# EAGLE design Secondary (EAGLE 5.12)

## Sheet 1 of 3
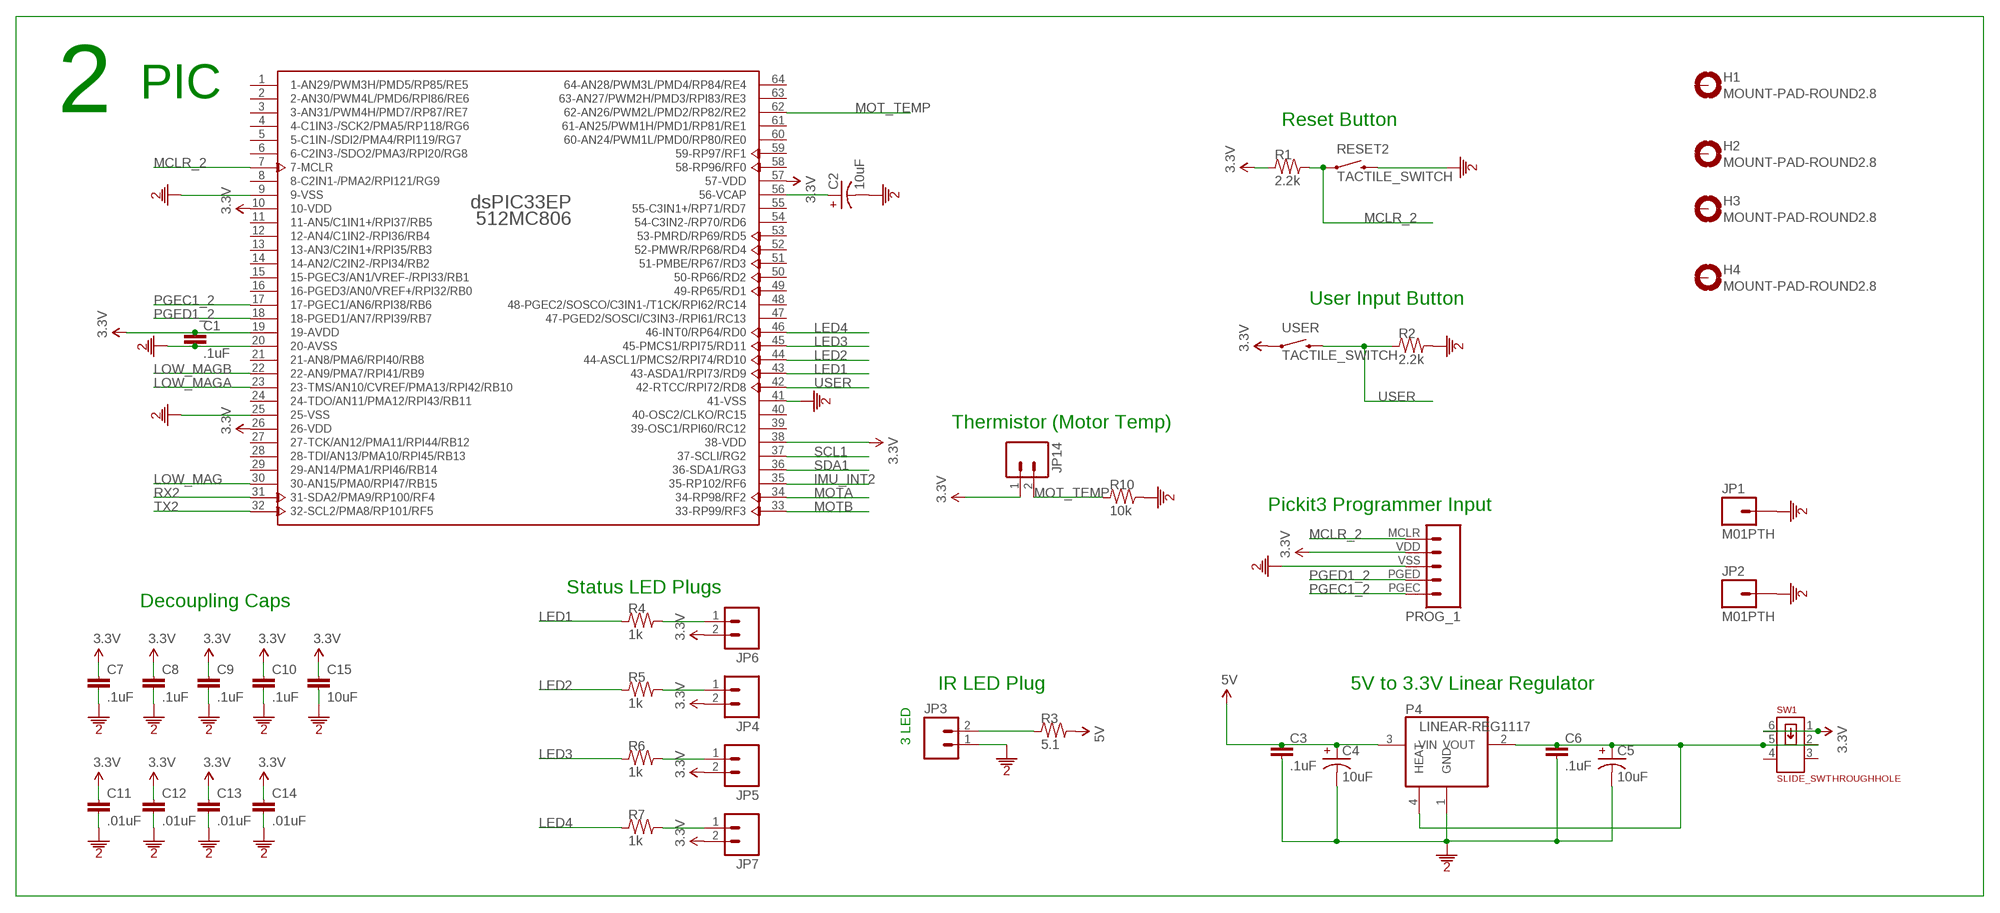
[diagram p0: schematic, sheet 1]

### Parts
C1  .1uF  CAP0603  [0603]
C2  10uF  CAP-POL0603  [0603-POL]
C3  .1uF  CAP1206  [1206]
C4  10uF  CAP-POL0603  [0603-POL]
C5  10uF  CAP-POL0603  [0603-POL]
C6  .1uF  CAP1206  [1206]
C7  .1uF  CAP0603  [0603]
C8  .1uF  CAP0603  [0603]
C9  .1uF  CAP0603  [0603]
C10  .1uF  CAP0603  [0603]
C11  .01uF  CAP0603  [0603]
C12  .01uF  CAP0603  [0603]
C13  .01uF  CAP0603  [0603]
C14  .01uF  CAP0603  [0603]
C15  10uF  CAP1206  [1206]
H1  MOUNT-PAD-ROUND2.8  [2,8-PAD]
H2  MOUNT-PAD-ROUND2.8  [2,8-PAD]
H3  MOUNT-PAD-ROUND2.8  [2,8-PAD]
H4  MOUNT-PAD-ROUND2.8  [2,8-PAD]
JP1  M01PTH  [1X01]
JP2  M01PTH  [1X01]
JP3  M02JST-PH-SMD  [JST-2-PH-SMD]
JP4  M02JST-PH-V  [JST-2-PH-V]
JP5  M02JST-PH-V  [JST-2-PH-V]
JP6  M02JST-PH-V  [JST-2-PH-V]
JP7  M02JST-PH-V  [JST-2-PH-V]
JP14  M02JST-PH-TH  [JST-2-PH-TH]
P4  LINEAR-REG1117  [SOT223]
PROG_1  M05PICKIT3  [1X05-PICKIT3]
R1  2.2k  R0603  [0603]
R2  2.2k  R0603  [0603]
R3  5.1  R0603  [0603]
R4  1k  R0603  [0603]
R5  1k  R0603  [0603]
R6  1k  R0603  [0603]
R7  1k  R0603  [0603]
R10  10k  R0603  [0603]
RESET2  TACTILE_SWITCH  [TACTILE_SWITCH]
SW1  SLIDE_SWTHROUGHHOLE  [SLIDE_SWITCH]
U$1  DSPIC33EP512MC806  [TQFP64_10X10]
USER  TACTILE_SWITCH  [TACTILE_SWITCH]

### Nets
3.3V: C1.1 C7.1 C8.1 C9.1 C10.1 C11.1 C12.1 C13.1 C14.1 C15.1 JP4.2 JP5.2 JP6.2 JP7.2 JP14.1 PROG_1.VDD R1.1 SW1.1 SW1.6 U$1.10(10-VDD) U$1.19(19-AVDD) U$1.26(26-VDD) U$1.38(38-VDD) U$1.57(57-VDD) USER.1 ; also sheet 2
5V: C3.1 C4.+ P4.3(VIN) R3.2 ; also sheet 2,3
GND2: C1.2 C2.- C3.2 C4.- C5.- C6.2 C7.2 C8.2 C9.2 C10.2 C11.2 C12.2 C13.2 C14.2 C15.2 JP1.1 JP2.1 JP3.1 P4.1(GND) PROG_1.VSS R2.2 R10.2 RESET2.2 U$1.9(9-VSS) U$1.20(20-AVSS) U$1.25(25-VSS) U$1.41(41-VSS) ; also sheet 2,3
IMU_INT2: U$1.35(35-RP102/RF6) ; also sheet 2
LED1: R4.1 U$1.43(43-ASDA1/RPI73/RD9)
LED2: R5.1 U$1.44(44-ASCL1/PMCS2/RPI74/RD10)
LED3: R6.1 U$1.45(45-PMCS1/RPI75/RD11)
LED4: R7.1 U$1.46(46-INT0/RP64/RD0)
LOW_MAG: U$1.30(30-AN15/PMA0/RPI47/RB15) ; also sheet 2
LOW_MAGA: U$1.23(23-TMS/AN10/CVREF/PMA13/RPI42/RB10) ; also sheet 2
LOW_MAGB: U$1.22(22-AN9/PMA7/RPI41/RB9) ; also sheet 2
MCLR_2: PROG_1.MCLR R1.2 RESET2.1 U$1.7(7-MCLR)
MOT_TEMP: JP14.2 R10.1 U$1.62(62-AN26/PWM2L/PMD2/RP82/RE2)
MOTA: U$1.34(34-RP98/RF2) ; also sheet 2
MOTB: U$1.33(33-RP99/RF3) ; also sheet 2
N$2: C2.+ U$1.56(56-VCAP)
N$3: JP3.2 R3.1
N$4: C5.+ C6.1 P4.2(VOUT) SW1.2 SW1.5
N$5: P4.4(HEAT)
N$6: JP7.1 R7.2
N$7: JP5.1 R6.2
N$8: JP4.1 R5.2
N$9: JP6.1 R4.2
PGEC1_2: PROG_1.PGEC U$1.17(17-PGEC1/AN6/RPI38/RB6)
PGED1_2: PROG_1.PGED U$1.18(18-PGED1/AN7/RPI39/RB7)
RX2: U$1.31(31-SDA2/PMA9/RP100/RF4) ; also sheet 2
SCL1: U$1.37(37-SCLI/RG2) ; also sheet 2
SDA1: U$1.36(36-SDA1/RG3) ; also sheet 2
TX2: U$1.32(32-SCL2/PMA8/RP101/RF5) ; also sheet 2
USER: R2.1 U$1.42(42-RTCC/RPI72/RD8) USER.2
Unconnected: H1.B2,8(MOUNT) H2.B2,8(MOUNT) H3.B2,8(MOUNT) H4.B2,8(MOUNT) SW1.3 SW1.4 U$1.1(1-AN29/PWM3H/PMD5/RP85/RE5) U$1.2(2-AN30/PWM4L/PMD6/RPI86/RE6) U$1.3(3-AN31/PWM4H/PMD7/RP87/RE7) U$1.4(4-C1IN3-/SCK2/PMA5/RP118/RG6) U$1.5(5-C1IN-/SDI2/PMA4/RPI119/RG7) U$1.6(6-C2IN3-/SDO2/PMA3/RPI20/RG8) U$1.8(8-C2IN1-/PMA2/RPI121/RG9) U$1.11(11-AN5/C1IN1+/RPI37/RB5) U$1.12(12-AN4/C1IN2-/RPI36/RB4) U$1.13(13-AN3/C2IN1+/RPI35/RB3) U$1.14(14-AN2/C2IN2-/RPI34/RB2) U$1.15(15-PGEC3/AN1/VREF-/RPI33/RB1) U$1.16(16-PGED3/AN0/VREF+/RPI32/RB0) U$1.21(21-AN8/PMA6/RPI40/RB8) U$1.24(24-TDO/AN11/PMA12/RPI43/RB11) U$1.27(27-TCK/AN12/PMA11/RPI44/RB12) U$1.28(28-TDI/AN13/PMA10/RPI45/RB13) U$1.29(29-AN14/PMA1/RPI46/RB14) U$1.39(39-OSC1/RPI60/RC12) U$1.40(40-OSC2/CLKO/RC15) U$1.47(47-PGED2/SOSCI/C3IN3-/RPI61/RC13) U$1.48(48-PGEC2/SOSCO/C3IN1-/T1CK/RPI62/RC14) U$1.49(49-RP65/RD1) U$1.50(50-RP66/RD2) U$1.51(51-PMBE/RP67/RD3) U$1.52(52-PMWR/RP68/RD4) U$1.53(53-PMRD/RP69/RD5) U$1.54(54-C3IN2-/RP70/RD6) U$1.55(55-C3IN1+/RP71/RD7) U$1.58(58-RP96/RF0) U$1.59(59-RP97/RF1) U$1.60(60-AN24/PWM1L/PMD0/RP80/RE0) U$1.61(61-AN25/PWM1H/PMD1/RP81/RE1) U$1.63(63-AN27/PWM2H/PMD3/RPI83/RE3) U$1.64(64-AN28/PWM3L/PMD4/RP84/RE4)

### Notes on the sheet
- 2 | PIC
- Reset Button
- User Input Button
- Thermistor (Motor Temp)
- Pickit3 Programmer Input
- Status LED Plugs
- Decoupling Caps
- IR LED Plug | 5V to 3.3V Linear Regulator
- 3 LED

## Sheet 2 of 3
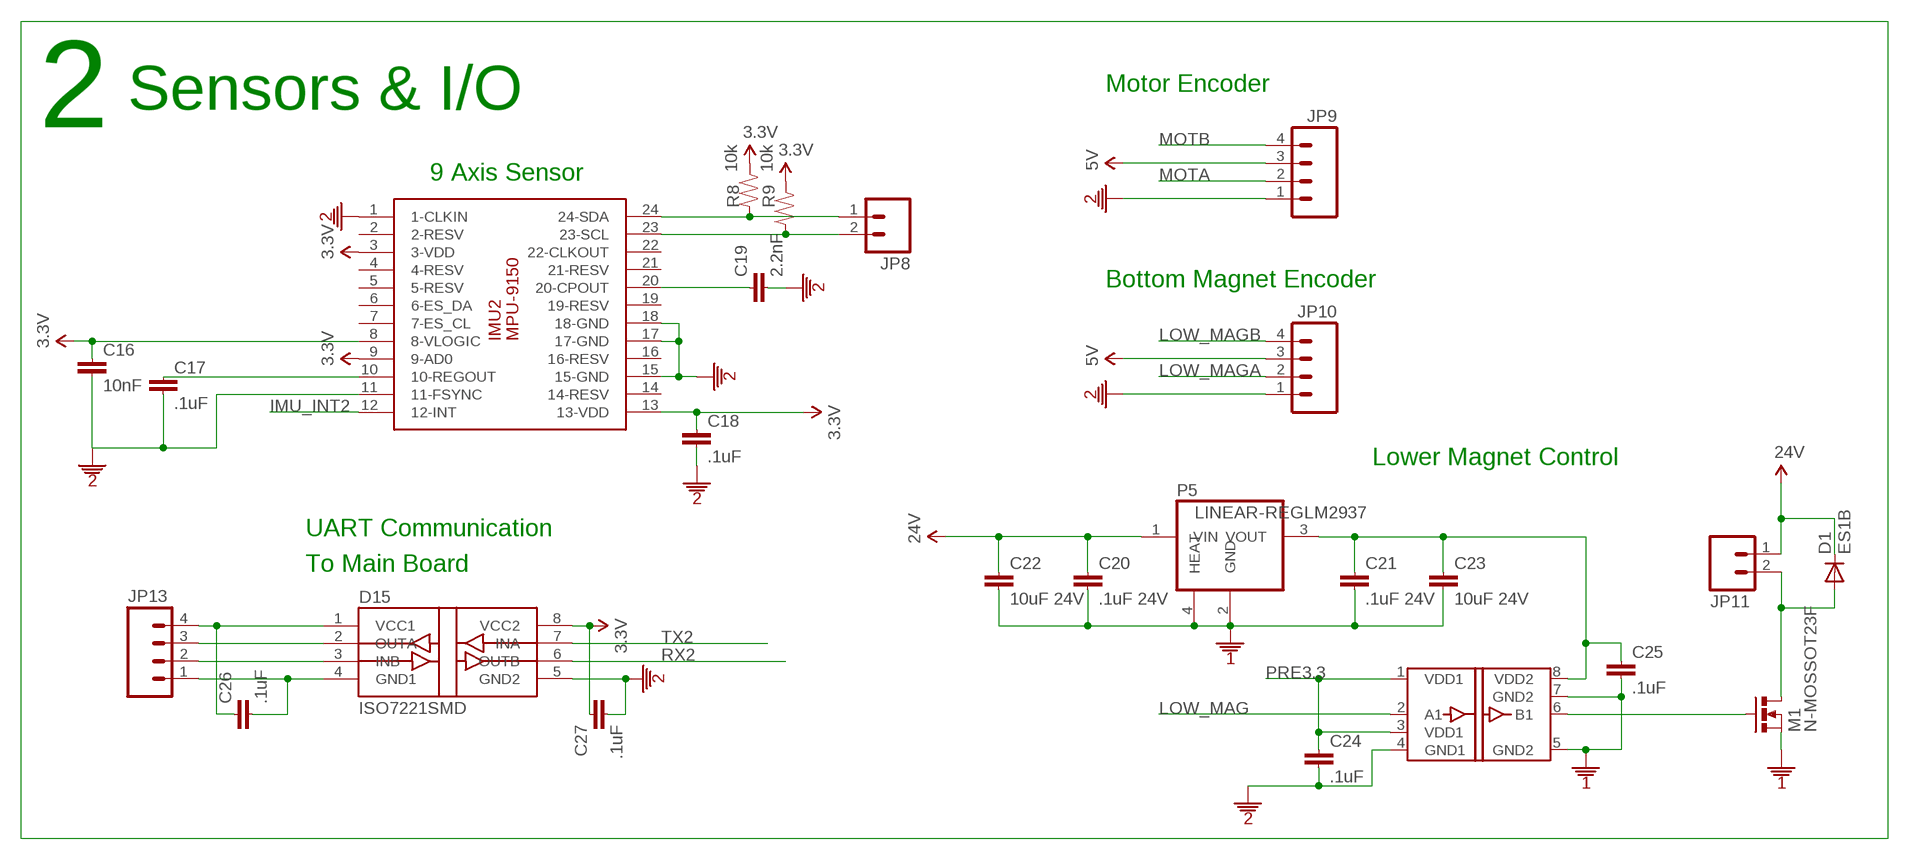
[diagram p1: schematic, sheet 2]

### Parts
C16  10nF  CAP0603  [0603]
C17  .1uF  CAP0603  [0603]
C18  .1uF  CAP0603  [0603]
C19  2.2nF  CAP0603  [0603]
C20  .1uF 24V  CAP0603  [0603]
C21  .1uF 24V  CAP0603  [0603]
C22  10uF 24V  CAP1206  [1206]
C23  10uF 24V  CAP1206  [1206]
C24  .1uF  CAP0603  [0603]
C25  .1uF  CAP0603  [0603]
C26  .1uF  CAP0603  [0603]
C27  .1uF  CAP0603  [0603]
D1  ES1B  DIODESMA  [SMA-DIODE]
D13  DIGITAL-ISOLATOR-1CHSOIC8-N  [SOIC8-N]
D15  ISO7221SMD  [SOIC-8]
IMU2  MPU-9150  [LGA24_4X4]
JP8  M02JST-PH-V  [JST-2-PH-V]
JP9  M04PH-TH  [JST-4-PH-TH]
JP10  M04PH-TH  [JST-4-PH-TH]
JP11  M02JST-PH-TH  [JST-2-PH-TH]
JP13  M04PH-TH  [JST-4-PH-TH]
M1  N-MOSSOT23F  [SOT23F]
P5  LINEAR-REGLM2937  [SOT223]
R8  10k  R0402  [0402]
R9  10k  R0402  [0402]

### Nets
3.3V: C16.1 C18.1 C27.1 D15.8(VCC2) IMU2.3(3-VDD) IMU2.8(8-VLOGIC) IMU2.9(9-AD0) IMU2.13(13-VDD) R8.2 R9.2 ; also sheet 1
5V: JP9.3 JP10.3 ; also sheet 1,3
24V: C20.1 C22.1 D1.C JP11.1 P5.1(VIN) ; also sheet 3
GND1: C20.2 C21.2 C22.2 C23.2 C25.2 D13.5(GND2) D13.7(GND2) M1.S P5.2(GND) P5.4(HEAT) ; also sheet 3
GND2: C16.2 C17.2 C18.2 C19.2 C24.2 C27.2 D13.4(GND1) D15.5(GND2) IMU2.1(1-CLKIN) IMU2.11(11-FSYNC) IMU2.15(15-GND) IMU2.17(17-GND) IMU2.18(18-GND) JP9.1 JP10.1 ; also sheet 1,3
IMU_INT2: IMU2.12(12-INT) ; also sheet 1
LOW_MAG: D13.2(A1) ; also sheet 1
LOW_MAGA: JP10.2 ; also sheet 1
LOW_MAGB: JP10.4 ; also sheet 1
MOTA: JP9.2 ; also sheet 1
MOTB: JP9.4 ; also sheet 1
N$11: C17.1 IMU2.10(10-REGOUT)
N$14: C19.1 IMU2.20(20-CPOUT)
N$15: C21.1 C23.1 C25.1 D13.8(VDD2) P5.3(VOUT)
N$17: D13.6(B1) M1.G
N$18: D1.A JP11.2 M1.D
N$19: C26.1 D15.1(VCC1) JP13.4
N$20: D15.2(OUTA) JP13.3
N$21: D15.3(INB) JP13.2
N$22: C26.2 D15.4(GND1) JP13.1
PRE3.3: C24.1 D13.1(VDD1) D13.3(VDD1)
RX2: D15.6(OUTB) ; also sheet 1
SCL1: IMU2.23(23-SCL) JP8.2 R9.1 ; also sheet 1
SDA1: IMU2.24(24-SDA) JP8.1 R8.1 ; also sheet 1
TX2: D15.7(INA) ; also sheet 1
Unconnected: IMU2.2(2-RESV) IMU2.4(4-RESV) IMU2.5(5-RESV) IMU2.6(6-ES_DA) IMU2.7(7-ES_CL) IMU2.14(14-RESV) IMU2.16(16-RESV) IMU2.19(19-RESV) IMU2.21(21-RESV) IMU2.22(22-CLKOUT)

### Notes on the sheet
- Motor Encoder
- 2 | Sensors & I/O
- 9 Axis Sensor
- Bottom Magnet Encoder
- Lower Magnet Control
- UART Communication
- To Main Board

## Sheet 3 of 3
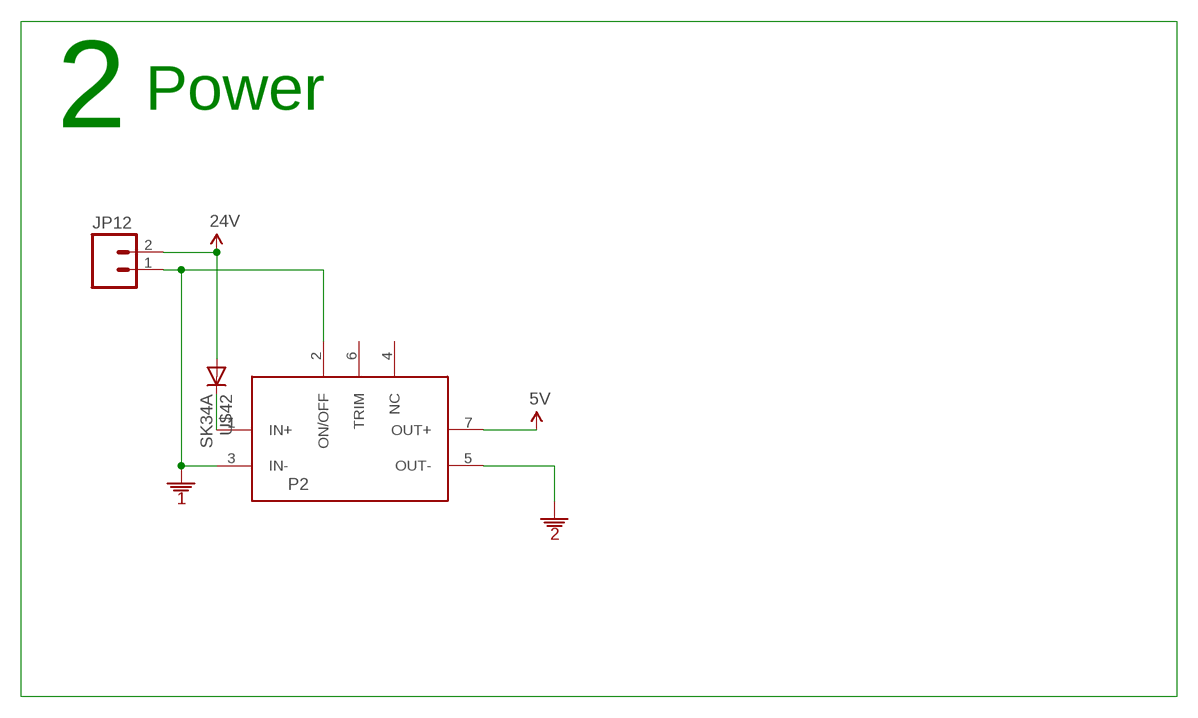
[diagram p2: schematic, sheet 3]

### Parts
JP12  M02JST-PH-TH  [JST-2-PH-TH]
P2  DC-DC-CONVERTER1.2A  [CC6-2405SF-E]
U$42  SK34A  DIODESMA  [SMA-DIODE]

### Nets
5V: P2.7(OUT+) ; also sheet 1,2
24V: JP12.2 U$42.A ; also sheet 2
GND1: JP12.1 P2.2(ON/OFF) P2.3(IN-) ; also sheet 2
GND2: P2.5(OUT-) ; also sheet 1,2
N$12: P2.1(IN+) U$42.C
Unconnected: P2.4(NC) P2.6(TRIM)

### Notes on the sheet
- 2 | Power

## Library data of the parts
C1 C3 C6-C27 = GibbotV5:CAP: Capacitor Standard 0603 ceramic capacitor, and 0.1" leaded capacitor.
C2 C4 C5 = GibbotV5:CAP-POL: CAPACITOR, American symbol
D1 U$42 = GibbotV5:DIODE: Diode These are standard reverse protection diodes and small signal diodes. SMA package can handle up to about 1A. SOD-323 can handle about 200mA. What the SOD-323 package when ordering, there are some mfgs out there that are 5-pin packages.
D13 = GibbotV5:DIGITAL-ISOLATOR-1CH
D15 = GibbotV6:ISO7221
H1-H4 = GibbotV5:MOUNT-PAD-ROUND: MOUNTING PAD, round
IMU2 = GibbotV5:MPU-9150
JP1 JP2 = GibbotV5:M01: Header 1 Standard 1-pin 0.1" header. Use with straight break away headers (SKU : PRT-00116), right angle break away headers (PRT-00553), swiss pins (PRT-00743), machine pins (PRT-00117), and female headers (PRT-00115).
JP3-JP8 JP11 JP12 JP14 = GibbotV5:M02: Header 2 Standard 2-pin 0.1" header. Use with straight break away headers (SKU : PRT-00116), right angle break away headers (PRT-00553), swiss pins (PRT-00743), machine pins (PRT-00117), and female headers (PRT-00115). Molex polarized connector foot print use with SKU : PRT-08233 with associated crimp pins and housings.
JP9 JP10 JP13 = GibbotV5:M04: Header 4 Standard 4-pin 0.1" header. Use with straight break away headers (SKU : PRT-00116), right angle break away headers (PRT-00553), swiss pins (PRT-00743), machine pins (PRT-00117), and female headers (PRT-00115). Molex polarized connector foot print use with SKU : PRT-08231 with associated crimp pins and housings. 1MM SMD Version SKU: PRT-10208
M1 = GibbotV5:N-MOS
P2 = GibbotV5:DC-DC-CONVERTER
P4 P5 = GibbotV5:LINEAR-REG
PROG_1 = GibbotV5:M05: Header 5 Standard 5-pin 0.1" header. Use with straight break away headers (SKU : PRT-00116), right angle break away headers (PRT-00553), swiss pins (PRT-00743), machine pins (PRT-00117), and female headers (PRT-00115). Molex polarized connector foot print use with SKU : PRT-08230 with associated crimp pins and housings.
R1-R10 = GibbotV5:R: RESISTOR, American symbol
RESET2 USER = GibbotV5:TACTILE_SWITCH
SW1 = GibbotV5:SLIDE_SW
U$1 = GibbotV5:DSPIC33EP512MC806

## Board
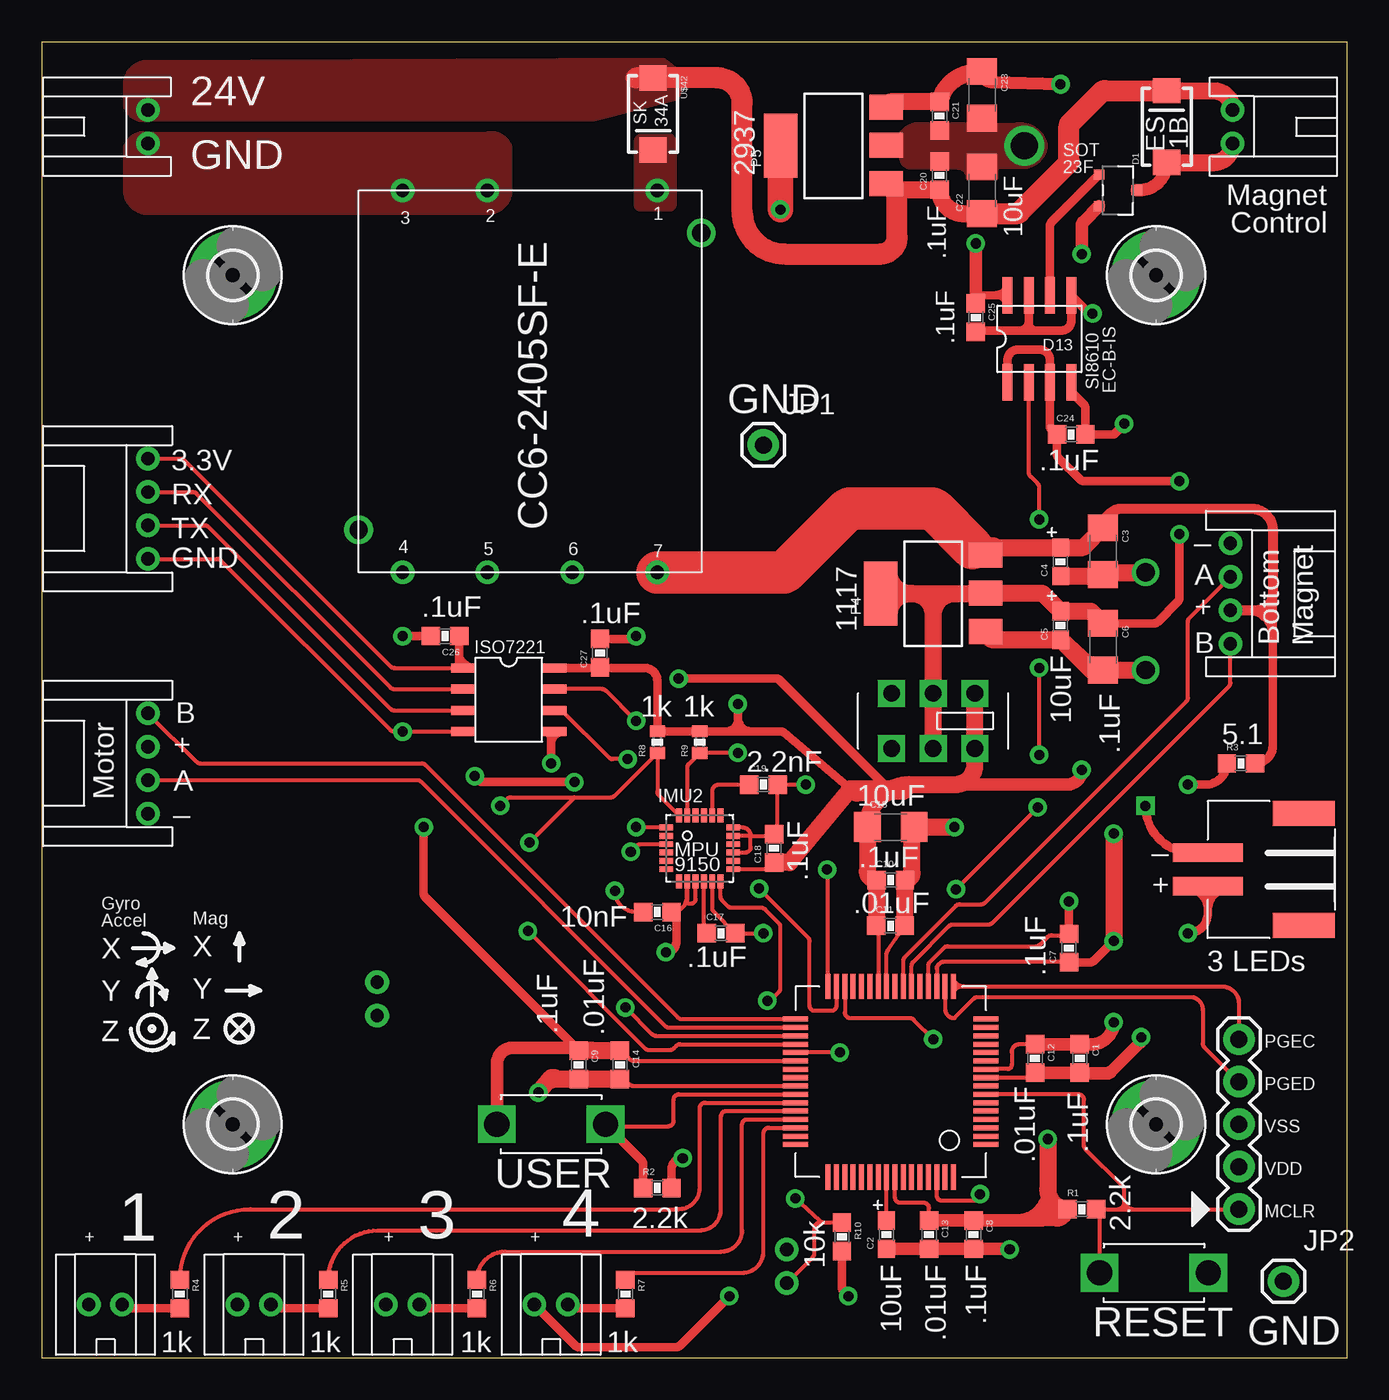
[diagram p3: board, top side]
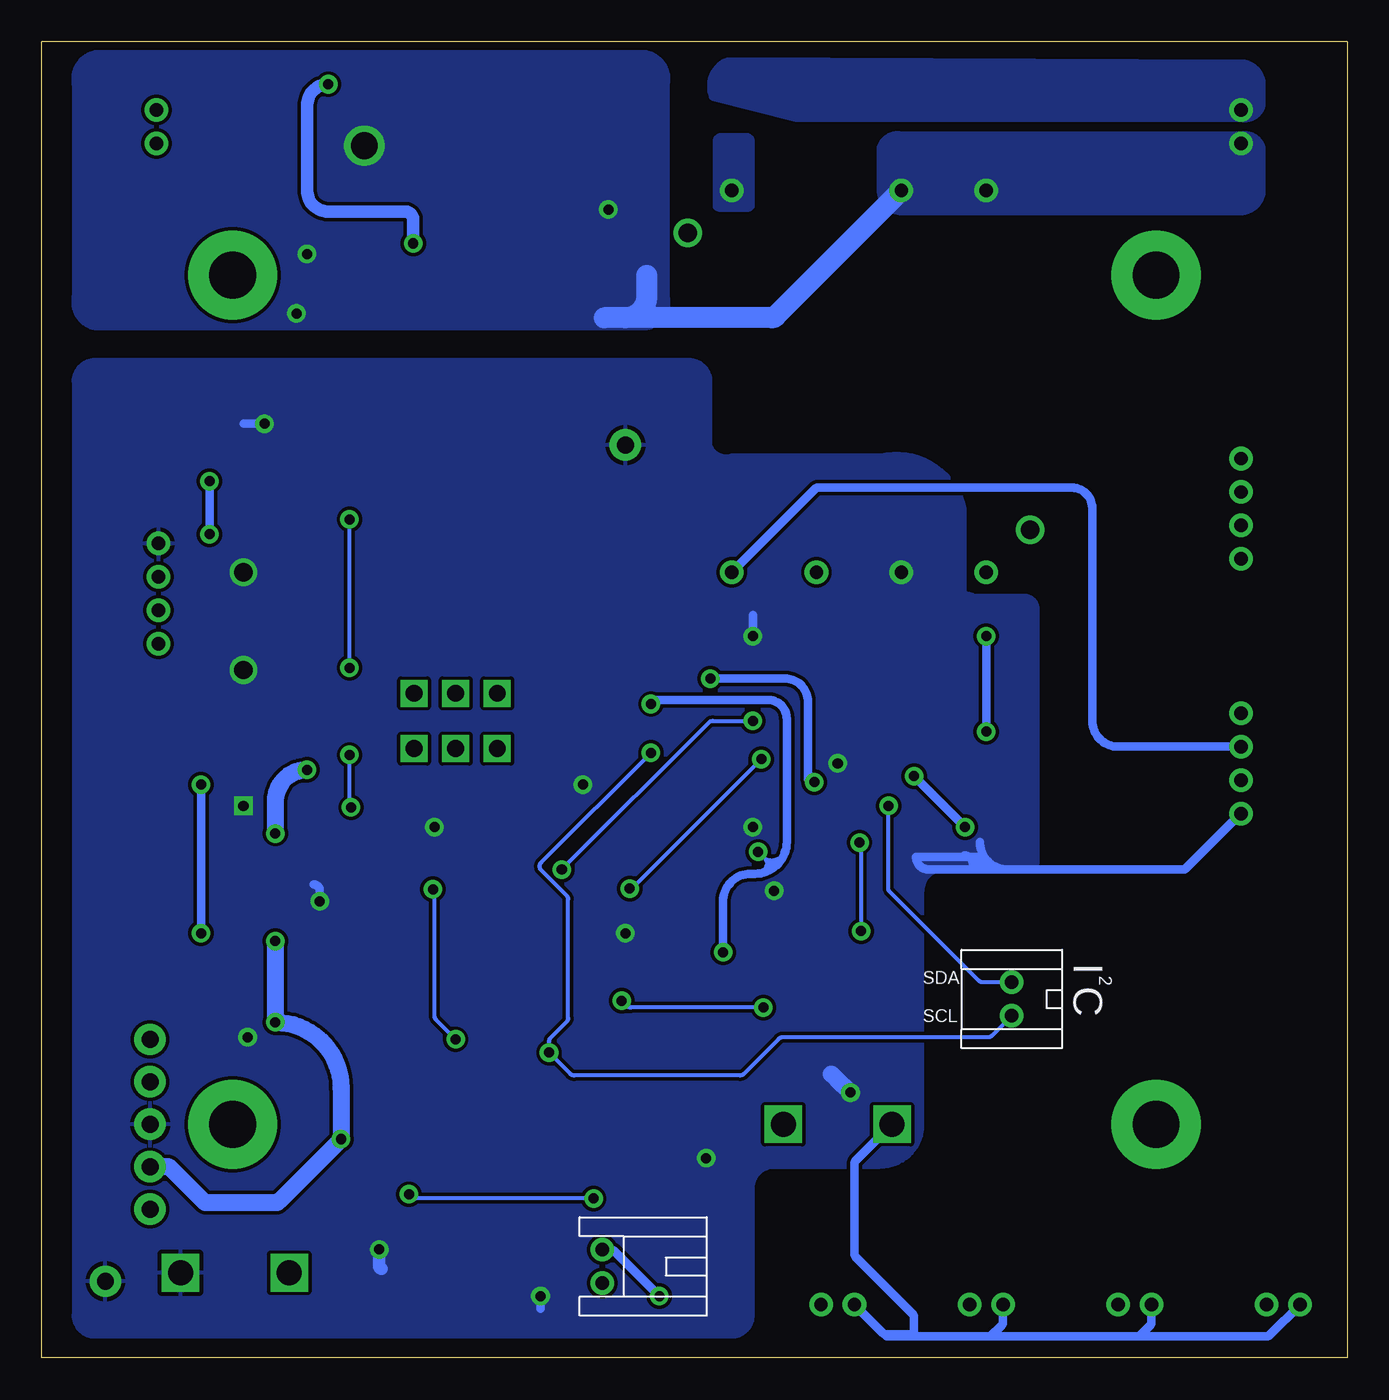
[diagram p4: board, bottom side, seen from below]

Size 78.11 x 78.74 mm. Coordinates in mm from the lower left corner, seen from the top.
Outline: 0,0 78.11,0 78.11,78.74 0,78.74 0,0
Copper layers (1*16): Top 0.035mm / dielectric 1.5mm / Bottom 0.035mm
Design rules "default *": minimum track width 8mil, minimum drill 20mil, track to track 8mil, track to pad 8mil, pad to pad 2mil, via to via 8mil, smd to smd 8mil, copper to edge 10mil, drill to drill 8mil, minimum pad ring 12mil, minimum via ring 10mil, stop-mask expansion 4mil, vias tented up to drill 0mil, thermal gap 10mil

### Footprints (pad centres in the part's own frame; a part is rotated, then mirrored left to right if it is on the bottom)
0603 = smd 1.1 x 1.1: 1 -0.85,0; 2 0.85,0
0603-POL = smd 1.1 x 1: + 0.85,0; - -0.85,0
1206 = smd 1.6 x 1.8: 1 -1.4,0; 2 1.4,0
SMA-DIODE = smd 1.52 x 1.63: A -2.15,0; C 2.15,0
SOIC8-N = smd 2.2 x 0.6: 1 -2.6,1.905; 2 -2.6,0.635; 3 -2.6,-0.635; 4 -2.6,-1.905; 5 2.6,-1.905; 6 2.6,-0.635; 7 2.6,0.635; 8 2.6,1.905
SOIC-8 = smd 1.5 x 0.55: 1 -2.7,1.905; 2 -2.7,0.635; 3 -2.7,-0.635; 4 -2.7,-1.905; 5 2.7,-1.905; 6 2.7,-0.635; 7 2.7,0.635; 8 2.7,1.905
2,8-PAD = drill 2.8 pad 5.334 round: B2,8 0,0
LGA24_4X4 = smd 0.8 x 0.35: 1 -2,1.25; 2 -2,0.75; 3 -2,0.25; 4 -2,-0.25; 5 -2,-0.75; 6 -2,-1.25; 13 2,-1.25; 14 2,-0.75; 15 2,-0.25; 16 2,0.25; 17 2,0.75; 18 2,1.25 | smd 0.35 x 0.85: 7 -1.25,-1.975; 8 -0.75,-1.975; 9 -0.25,-1.975; 10 0.25,-1.975; 11 0.75,-1.975; 12 1.25,-1.975; 19 1.25,1.975; 20 0.75,1.975; 21 0.25,1.975; 22 -0.25,1.975; 23 -0.75,1.975; 24 -1.25,1.975
1X01 = drill 1.016 pad 1.88 round: 1 0,0
JST-2-PH-SMD = smd 1.1 x 4.2: 1 -1,-7.7; 2 1,-7.7 | smd 1.5 x 3.7: P$1 -3.35,-1.95; P$4 3.35,-1.95
JST-2-PH-V = drill 0.8 round: 1 -1,0; 2 1,0
JST-4-PH-TH = drill 0.8 round: 1 -3,-6.35; 2 -1,-6.35; 3 1,-6.35; 4 3,-6.35
JST-2-PH-TH = drill 0.8 round: 1 -1,-6.35; 2 1,-6.35
SOT23F = smd 0.6 x 0.65: D 0,1.125; G -0.95,-1.125; S 0.95,-1.125
CC6-2405SF-E = drill 0.8 round: 1 -11.43,7.62; 2 -11.43,-2.54; 3 -11.43,-7.62; 4 11.43,-7.62; 5 11.43,-2.54; 6 11.43,2.54; 7 11.43,7.62 | drill 1.1 round: P$9 8.89,-10.25; P$10 -8.89,10.25
SOT223 = smd 1.499 x 2.007: 1 -2.261,-3.15; 2 0.025,-3.15; 3 2.311,-3.15 | smd 3.81 x 2.007: 4 0,3.15
1X05-PICKIT3 = drill 1.016 pad 1.88 round: MCLR 1.27,-1.016; PGEC 11.43,-1.016; PGED 8.89,-1.016; VDD 3.81,-1.016; VSS 6.35,-1.016
0402 = smd 0.7 x 0.9: 1 -0.65,0; 2 0.65,0
TACTILE_SWITCH = drill 1.5 square: 1 -3.25,0; 2 3.25,0
SLIDE_SWITCH = drill 1 square: 1 -2.489,1.651; 2 0,1.651; 3 2.489,1.651; 4 2.489,-1.651; 5 0,-1.651; 6 -2.489,-1.651
TQFP64_10X10 = smd 1.5 x 0.3: 1 -5.7,3.75; 2 -5.7,3.25; 3 -5.7,2.75; 4 -5.7,2.25; 5 -5.7,1.75; 6 -5.7,1.25; 7 -5.7,0.75; 8 -5.7,0.25; 9 -5.7,-0.25; 10 -5.7,-0.75; 11 -5.7,-1.25; 12 -5.7,-1.75; 13 -5.7,-2.25; 14 -5.7,-2.75; 15 -5.7,-3.25; 16 -5.7,-3.75; 33 5.7,-3.75; 34 5.7,-3.25; 35 5.7,-2.75; 36 5.7,-2.25; 37 5.7,-1.75; 38 5.7,-1.25; 39 5.7,-0.75; 40 5.7,-0.25; 41 5.7,0.25; 42 5.7,0.75; 43 5.7,1.25; 44 5.7,1.75; 45 5.7,2.25; 46 5.7,2.75; 47 5.7,3.25; 48 5.7,3.75 | smd 0.3 x 1.5: 17 -3.75,-5.7; 18 -3.25,-5.7; 19 -2.75,-5.7; 20 -2.25,-5.7; 21 -1.75,-5.7; 22 -1.25,-5.7; 23 -0.75,-5.7; 24 -0.25,-5.7; 25 0.25,-5.7; 26 0.75,-5.7; 27 1.25,-5.7; 28 1.75,-5.7; 29 2.25,-5.7; 30 2.75,-5.7; 31 3.25,-5.7; 32 3.75,-5.7; 49 3.75,5.7; 50 3.25,5.7; 51 2.75,5.7; 52 2.25,5.7; 53 1.75,5.7; 54 1.25,5.7; 55 0.75,5.7; 56 0.25,5.7; 57 -0.25,5.7; 58 -0.75,5.7; 59 -1.25,5.7; 60 -1.75,5.7; 61 -2.25,5.7; 62 -2.75,5.7; 63 -3.25,5.7; 64 -3.75,5.7

### Placement (x,y rotation side)
C1  62.1,17.91 270 top
C2  50.55,7.37 90 top
C3  63.5,48.26 270 top
C4  60.96,47.62 90 top
C5  60.96,43.81 90 top
C6  63.5,42.55 270 top
C7  61.47,24.51 90 top
C8  55.75,7.37 270 top
C9  32.13,17.53 270 top
C10  50.8,28.57 0 top
C11  50.79,25.84 0 top
C12  59.44,17.91 270 top
C13  53.09,7.37 270 top
C14  34.59,17.53 270 top
C15  50.8,31.75 0 top
C16  36.83,26.67 180 top
C17  40.64,25.4 0 top
C18  43.81,30.48 90 top
C19  43.18,34.29 0 top
C20  53.72,70.74 90 top
C21  53.72,74.3 270 top
C22  56.26,69.85 90 top
C23  56.26,75.56 270 top
C24  61.59,55.24 0 top
C25  55.88,62.23 270 top
C26  24.13,43.18 180 top
C27  33.4,42.16 90 top
D1  67.31,73.66 90 top
D13  59.69,60.96 90 top
D15  27.94,39.37 0 top
H1  11.43,64.77 0 top
H2  66.67,64.77 0 top
H3  11.43,13.97 0 top
H4  66.67,13.97 0 top
IMU2  39.37,30.48 0 top
JP1  43.18,54.61 0 top
JP2  74.3,4.57 0 top
JP3  77.47,29.21 270 top
JP4  12.7,3.17 180 top
JP5  21.59,3.17 180 top
JP6  3.81,3.17 180 top
JP7  30.48,3.17 180 top
JP8  20.07,21.46 270 bottom
JP9  0,35.56 90 top
JP10  77.47,45.72 270 top
JP11  77.6,73.66 270 top
JP12  0,73.66 90 top
JP13  0,50.8 90 top
JP14  38.23,5.46 270 bottom
M1  64.39,69.85 270 top
P2  29.21,58.42 270 top
P4  53.34,45.72 90 top
P5  47.37,72.52 90 top
PROG_1  70.61,7.62 90 top
R1  62.23,8.89 0 top
R2  36.83,10.16 0 top
R3  71.75,35.56 0 top
R4  8.26,3.81 270 top
R5  17.14,3.81 270 top
R6  26.04,3.81 270 top
R7  34.92,3.81 270 top
R8  36.83,36.83 90 top
R9  39.37,36.83 90 top
R10  47.88,7.24 270 top
RESET2  66.55,5.08 0 top
SW1  53.34,38.1 180 top
U$1  50.8,16.51 180 top
U$42  36.58,74.42 270 top
USER  30.48,13.97 0 top

### Tracks (layer width: path | path; a pad name or v marks a point on that pad's centre or on a via)
3.3V  (via drill 0.6)
  Top 0.254: U$1.26 50.05,25.3 arc90 C11.1 | 38.62,27.61 IMU2.8 38.62,27.32 | 38.62,27.61 arc-90 C16.1 arc-90 37.8,26.55 37.8,26.49 | 38.86,27.18 arc90 39.12,27.44 | 38.86,27.18 38.71,27.18 arc-90 38.62,27.27 38.62,27.61 | IMU2.13 43.41,29.23 arc90 C18.1 | 34.78,18.27 arc-90 C14.1 35.2,17.84 arc42 35.41,17.76 U$1.38 | C13.1 53.09,8.95 arc90 52.77,9.27 51.37,9.27 arc-90 51.05,9.59 U$1.57 arc90 U$1.57 | 37.97,26.67 37.8,26.49 | 37.8,26.49 37.72,26.42 | C12.1 58.51,18.76 arc90 58.04,18.29 58.04,17.53 arc-90 57.78,17.27 56.51,17.27 arc90 U$1.10 | 61.43,23.62 C7.1 arc45 61.41,23.69 53.95,23.69 arc45 53.73,23.59 53.64,23.51 arc45 53.55,23.28 U$1.19 | 39.12,27.44 IMU2.9 | 38.86,27.18 arc90 39.12,27.44 | v35.24,30.26 35.62,30.64 arc-45 35.84,30.73 IMU2.3
  Top 0.508: 32.04,18.29 C9.1 arc90 31.96,18.54 22.95,27.55 arc-45 22.86,27.78 v22.86,31.75 | D15.8 33.36,41.27 C27.1 arc90 33.44,41.27 36.07,41.27 arc-90 36.83,40.51 R8.2 R9.2 40.98,37.48 | 42.42,37.48 40.98,37.48 | 48.39,34.04 44.4,37.41 arc40 44.19,37.48 42.42,37.48 | 49.53,33.78 50.34,34.35 44.15,40.55 arc45 43.92,40.64 v38.1,40.64 | 32.85,18.54 arc-90 33.02,18.38 | 37.97,26.67 37.97,24.89 arc-90 v37.34,24.26 | 42.42,37.48 arc-90 41.66,38.24 | v41.66,39.12 41.66,38.15 arc-90 40.98,37.48 | C7.1 62.73,23.66 arc45 62.96,23.75 v64.14,24.93 | v31.88,34.44 26.39,34.44 arc-45 26.17,34.53 v25.91,34.8 | JP7.2 31.93,0.73 arc45 32.15,0.64 37.97,0.64 arc45 38.19,0.73 v41.15,3.68
  Top 0.762: USER.1 27.23,17.58 arc-90 28.19,18.54 32.85,18.54 | C13.1 C8.1 59.75,8.22 arc90 60.4,8.87 60.4,8.69 arc-90 59.96,8.24 60.68,8.24 arc-90 60.71,8.22 arc90 R1.1 | C1.1 C12.1 62.83,18.76 arc90 v64.14,20.07 | v62.23,35.18 arc-90 61.34,34.29 54.61,34.29 | 60.2,10.07 arc-90 58.34,8.22
  Top 1.016: SW1.6 SW1.1 55.83,35.51 arc-90 54.61,34.29 51.94,34.29 | C11.1 C10.1 arc-90 49.4,29.12 C15.1 arc-90 51.94,34.29 | C9.1 33.02,18.38 C14.1 | C18.1 44.74,29.63 48.39,34.04 51.69,34.04 arc90 51.7,34.05 | 48.77,33.78 49.53,33.78 50.55,33.78 50.67,33.91 51.56,33.91 51.7,34.05 | 51.7,34.05 51.94,34.29 | R1.1 arc-90 60.2,10.07 v60.2,13.08 | v64.14,31.37 v64.14,24.93
  Bottom 0.254: v35.24,30.26 arc45 35.22,30.25 34.4,29.43 arc-45 34.42,29.72 34.03,29.84 | 34.27,29.3 arc90 34.42,29.15 34.84,29.15 | 34.84,29.15 arc90 35.03,28.96 35.43,28.96 | 34.03,29.84 34.04,29.84 | 34.76,29.81 arc-45 34.03,29.84 | 34.76,29.81 34.67,29.59 arc45 34.71,29.5 34.84,29.15 | 34.76,29.81 35.18,30.23
  Bottom 0.508: v41.66,39.12 arc90 41.4,39.37 34.67,39.37 arc90 33.53,38.23 33.53,30.86 arc90 35.43,28.96 35.69,28.96 arc-90 37.34,27.3 v37.34,24.26 | USER.1 29.39,11.81 arc-45 29.48,11.59 29.48,6.24 arc-45 29.39,6.02 26,2.63 arc45 25.91,2.41 25.91,1.4 27.18,1.4 | 12.45,1.27 21.34,1.27 | 21.34,1.27 27.05,1.27 | 27.05,1.27 27.57,1.27 | 12.45,1.27 4.85,1.27 arc-45 4.62,1.36 JP6.2 | 12.45,1.27 11.79,1.92 arc-45 11.7,2.15 JP4.2 | 21.34,1.27 20.68,1.92 arc-45 20.59,2.15 JP5.2 | 27.18,1.4 27.57,1.4 arc45 27.8,1.49 JP7.2 | 27.05,1.27 27.18,1.4 | 64.22,25.02 arc90 v64.14,24.93 64.3,24.77 arc-45 64.39,24.55 64.39,24.23 | v38.1,40.64 33.66,40.64 arc90 32.26,39.24 32.26,34.67 arc-90 v31.88,34.44 | v22.86,31.75 v25.91,34.8 | JP14.1 44.06,6.46 arc45 43.83,6.37 v41.15,3.68
  Bottom 1.016: v64.14,24.93 v64.14,20.07 arc90 60.2,16.13 v60.2,13.08 63.91,9.36 arc45 64.14,9.27 68.19,9.27 arc45 68.42,9.36 70.39,11.34 arc-45 70.62,11.43 PROG_1.VDD | v62.23,35.18 arc-90 64.14,33.27 v64.14,31.37
5V
  Top 0.508: JP10.3 72.12,44.72 arc-90 73.66,43.18 | 73.66,44.72 73.66,43.18 | 73.66,45.72 73.66,44.72 | 73.66,44.72 JP10.3 | 73.66,43.18 73.66,36.62 arc-90 R3.2
  Top 0.61: JP10.3 72.66,44.72 arc90 73.66,45.72 73.66,49.53 arc90 72.39,50.8 64.64,50.8 arc90 C3.1
  Top 1.016: 56.93,48.48 C4.+ 62.21,48.48 arc45 62.39,48.55 C3.1
  Top 1.27: 56.11,48.03 55.35,48.03 54.23,49.15 | 56.11,48.03 P4.3 | 56.11,48.03 55.69,48.45 55.71,48.48 56.93,48.48
  Top 2.54: P2.7 44.32,46.99 arc45 44.54,47.08 48.17,50.71 arc-45 48.39,50.8 53.21,50.8 arc-45 53.43,50.71 55.69,48.45
  Bottom 0.508: JP9.3 13.7,36.56 arc90 15.24,38.1 15.24,50.8 arc-90 16.51,52.07 31.62,52.07 arc-45 31.84,51.98 P2.7
24V
  Top 1.016: P5.1 50.89,69.89 51.05,69.89 C20.1 arc90 55.16,68.45 C22.1 | D1.C 70.1,75.81 arc-90 JP11.1
  Top 1.27: 51.05,69.89 arc-90 51.18,69.76 51.18,67.06 arc-90 50.16,66.04 44.45,66.04 arc-90 41.91,68.58 41.91,75.06 arc90 40.39,76.58 36.57,76.58 | C22.1 58.28,68.45 arc45 58.51,68.54 61.38,71.41 arc45 61.47,71.63 61.47,73.66 arc-45 61.56,73.88 63.41,75.73 arc-45 63.63,75.82 67.29,75.82 arc-45 D1.C | 36.57,76.58 35.56,76.58 | 36.57,76.58 arc-90 U$42.A
  pour Bottom (no thermals): 6.35,77.47 37.08,77.6 arc-90 37.97,75.44 33.02,74.17 6.35,74.17 arc-90 5.08,74.93 5.08,76.2 arc-90
  pour Top (no thermals): 6.35,77.47 37.08,77.6 arc-90 37.97,75.44 33.02,74.17 6.35,74.17 arc-90 5.08,74.93 5.08,76.2 arc-90
GND1  (via drill 0.6, 1.6)
  Top 0.508: v62.87,62.48 62.67,62.48 D13.5 61.59,61.98 arc-90 60.96,61.47 59.44,61.47 | C25.2 55.88,61.47 58.55,61.47 | 58.55,61.47 59.44,61.47 | 58.55,61.47 arc90 59.05,61.98 | D13.7 59.05,61.85 arc90 59.44,61.47
  Top 0.762: v62.23,66.04 62.23,67.73 arc-45 62.32,67.96 M1.S
  Top 1.524: P5.4 44.2,72.52 v44.2,68.71
  Bottom 1.27: 43.18,62.23 arc-90 41.91,63.5 41.91,64.77 | P2.2 34.2,62.32 arc45 34.42,62.23 44.45,62.23
  other vias: 58.8,72.52
  pour Bottom (no thermals): 6.35,73.15 26.67,73.15 arc-90 27.94,72.39 27.94,69.85 arc-90 26.67,68.58 6.35,68.58 arc-90 5.08,69.85 5.08,72.39 arc-90
  pour Top (no thermals): 6.35,73.15 26.67,73.15 arc-90 27.94,72.39 27.94,69.85 arc-90 26.67,68.58 6.35,68.58 arc-90 5.08,69.85 5.08,72.39 arc-90
  pour Bottom: 74.93,61.59 41.91,61.59 arc-90 40.64,63.5 40.64,76.2 arc-90 41.91,78.11 74.93,78.11 arc-90 76.2,76.2 76.2,63.5 arc-90
  pour Top (no thermals): 58.29,73.79 arc-90 60.07,72.52 arc-90 58.55,71.25 56.9,71.25 56.9,73.79
  pour Top (no thermals): 55.63,73.79 52.45,73.79 arc90 51.18,72.52 arc90 52.45,71.25 55.63,71.25
  pour Top (no thermals): 54.99,73.79 57.53,73.79 57.53,71.25 54.99,71.25
  pour Top (no thermals): 50.93,73.15 50,73.15 arc90 49.78,72.94 49.78,72.21 arc90 49.97,72.02 51.21,72.02 arc-90 51.44,71.79 arc90 52.01,71.22 54.79,71.22 arc-90 55.41,70.6 57.1,70.6 arc-90 57.11,70.59 57.11,70.99 arc-90 57.43,71.31 57.43,73.28 arc90 57.04,73.67 57.04,74.73 arc90 57.01,74.75 55.51,74.75 arc-90 55.47,74.79 55.47,74.03 arc-90 55.16,73.71 52.13,73.71 arc90 51.74,73.32 51.74,73.22 arc-90 51.54,73.01
GND2  (via drill 0.6, 1.1)
  Top 0.254: U$1.25 50.55,24.17 arc-45 50.64,24.39 C11.2 | v45.72,34.29 C19.2 44.03,31.55 C18.2 43.72,31.23 42.42,31.23 | C16.2 35.56,26.67 arc-90 v34.29,27.94 | v43.18,25.4 C17.2 40.21,26.68 arc-45 40.12,26.9 IMU2.11 | 42.42,31.23 IMU2.17 | IMU2.15 42.1,30.23 arc90 42.42,30.55 42.42,31.23 | IMU2.18 41.92,31.73 arc-90 42.42,31.23 | IMU2.1 35.58,31.73 arc-90 v35.56,31.75 | C14.2 arc-90 34.76,16.77 35.18,16.35 arc45 35.4,16.26 U$1.41 | 62.23,17.02 59.4,17.02 arc90 59.02,16.64 arc90 C12.2 arc-90 59.14,16.76 U$1.9 arc90 U$1.9 | 61.43,25.4 C7.2 arc-45 61.26,25.27 60.42,25.27 arc45 60.19,25.18 59.72,24.71 arc-45 59.49,24.61 54.2,24.61 arc45 53.97,24.52 53.14,23.69 arc45 53.05,23.47 U$1.20
  Top 0.508: v64.77,55.88 64.14,55.24 C24.2 62.45,56.8 arc45 62.35,57.03 61.59,57.78 D13.4 | JP3.1 68.85,30.21 arc-90 v66.04,33.02 | R2.2 37.68,11.26 arc-90 v38.35,11.94 | C27.2 35.39,43.01 v35.56,43.18 | C7.2 v61.47,27.3 | 30.48,36.7 arc-90 31.11,37.44 | 30.48,36.7 v30.48,35.56 | 30.48,36.7 30.48,37.01 arc90 30.14,37.47 30.63,37.45 arc90 D15.5 | R10.2 47.88,4.2 arc45 47.97,3.97 v48.26,3.68
  Top 0.762: C2.- C13.2 C8.2 57.87,6.52 arc-90 v57.91,6.48 | C12.2 C1.2 | 62.23,17.02 63.75,17.02 arc45 63.97,17.11 65.69,18.83 arc45 65.79,19.05 v65.79,19.18
  Top 1.016: C5.- 56.98,42.97 arc-90 P4.1 | C4.- 63.31,46.77 arc45 63.49,46.85 C3.2 63.56,46.92 arc-45 63.73,46.99 v66.04,46.99 | C5.- 62.71,41.22 arc45 62.88,41.15 C6.2 | C5.- 63.21,40.89 arc45 63.39,41.15 v66.04,41.15 | C11.2 C10.2 arc90 52.07,29 52.07,31.75 C15.2 v54.61,31.75 | C14.2 C9.2 30.73,16.68 | v29.72,15.88 30.48,16.77 30.64,16.77 arc-90 30.73,16.68 | 30.73,16.68 30.54,16.68 arc90 30.49,16.62
  Bottom 0.508: v64.77,55.88 66.04,55.88 | v30.48,35.56 30.61,35.56 | JP9.1 9.61,29.3 arc45 9.83,29.21 20.32,29.21 | v35.56,43.18 35.56,44.45 | v61.47,27.3 61.47,27.94 arc-90 61.85,28.32 | 20.32,29.21 arc90 21.97,30.86 | 20.32,29.21 25.03,29.21 arc90 25.79,29.97 21.97,29.97 arc90 21.59,29.59 21.72,29.59 arc-90 21.84,29.46 22.39,29.54 arc-90 22.9,30.05 | v48.26,3.68 48.26,2.92
  Bottom 0.762: v57.91,6.48 57.91,5.46 arc-90 57.78,5.33
  Bottom 1.016: v29.72,15.88 30.56,16.69 30.86,16.98
  pour Bottom: 39.37,59.69 74.93,59.69 arc-90 76.2,58.42 76.2,2.54 arc-90 74.93,1.27 36.83,1.27 arc-90 35.56,2.54 35.56,10.16 arc90 34.29,11.43 27.94,11.43 arc-90 25.4,13.97 25.4,27.94 arc90 24.13,29.21 22.86,29.21 arc-90 21.59,30.48 21.59,44.45 arc-90 22.86,45.72 22.86,50.8 arc-90 27.94,53.98 36.83,53.98 arc90 38.1,54.61 38.1,58.42 arc-90
  pour Bottom (no thermals): 25.53,48.13 27.81,48.13 27.81,45.85 25.53,45.85
  pour Bottom: 23.24,45.59 19.3,45.59 arc90 18.54,44.83 18.54,29.59 arc90 18.92,29.21 25.65,29.21 arc90 26.04,29.59 26.04,44.58 arc90 25.15,45.47
IMU_INT2  (via drill 0.6)
  Top 0.254: IMU2.12 40.62,27.58 arc45 40.71,27.36 41.05,27.02 arc45 41.28,26.92 43.05,26.92 arc-45 43.27,26.83 44.1,26 arc-45 44.2,25.78 44.2,22.1 arc-45 44.1,21.88 43.68,21.45 arc-45 43.45,21.36 v43.41,21.36 | v34.92,20.95 36.53,19.35 arc45 36.75,19.26 U$1.35
  Bottom 0.254: v43.41,21.36 43.09,21.05 arc-45 42.87,20.95 v34.92,20.95
LED1
  Top 0.254: U$1.43 39.69,15.26 arc90 39.37,14.94 39.37,10.16 arc-90 38.1,8.89 12.48,8.89 arc90 R4.1
LED2
  Top 0.254: R5.1 arc-90 20.11,7.62 39.37,7.62 arc90 40.64,8.89 40.64,14.44 arc-90 40.96,14.76 U$1.44
LED3
  Top 0.254: U$1.45 42.2,14.26 arc90 41.91,13.97 41.91,7.62 arc-90 40.64,6.35 27.73,6.35 arc90 R6.1
LED4
  Top 0.254: U$1.46 43.5,13.76 arc90 43.18,13.44 43.18,6.35 arc-90 41.91,5.08 35.34,5.08 arc90 R7.1
LOW_MAG  (via drill 0.6)
  Top 0.254: U$1.30 48.05,20.66 arc45 48.14,20.44 48.17,20.41 arc45 48.39,20.32 51.94,20.32 arc-45 52.16,20.23 v53.34,19.05 | v54.7,28.03 v59.6,32.93 | v59.69,36.07 v59.69,41.27 | D13.2 59.05,52.97 arc45 59.15,52.74 59.6,52.29 arc-45 59.69,52.07 v59.69,50.16
  Bottom 0.254: v53.34,19.05 54.52,20.23 arc45 54.61,20.45 54.61,27.81 arc-45 v54.7,28.03 | 59.69,33.15 arc-45 v59.6,32.93 arc45 59.69,33.15 | 59.69,33.15 v59.69,36.07 | v59.69,41.27 59.69,49.4 v59.69,50.16
LOW_MAGA
  Top 0.254: JP10.2 68.67,44.27 arc45 68.58,44.05 68.58,39.5 arc-45 68.49,39.28 56.43,27.22 arc-45 56.21,27.13 54.92,27.13 arc45 54.7,27.03 51.64,23.98 arc45 51.55,23.76 U$1.23
LOW_MAGB
  Top 0.254: JP10.4 71.12,40.39 arc-45 71.03,40.17 56.87,26.01 arc-45 56.65,25.92 54.51,25.92 arc45 54.28,25.82 52.14,23.68 arc45 52.05,23.46 U$1.22
MCLR_2
  Top 0.254: RESET2.1 63.3,8.67 R1.2 64.39,8.89 | 64.39,8.89 65.28,8.89 | 65.28,8.89 PROG_1.MCLR | 64.39,8.89 arc90 64.77,9.27 | 65.28,8.89 arc-90 64.77,9.4 64.77,10.03 arc45 64.68,10.25 62.45,12.48 arc-45 62.36,12.7 62.36,15.44 arc90 62.04,15.76 U$1.7
MOT_TEMP  (via drill 0.6)
  Top 0.254: U$1.62 53.55,9.7 arc90 53.85,9.4 55.75,9.4 arc90 v56.13,9.78 | v45.09,9.53 46.55,8.18 arc45 46.78,8.09 | 46.78,8.09 R10.1 | 46.78,8.09 46.57,8.09 arc90 46.23,7.75 46.23,6.24 arc-45 46.13,6.02 JP14.2
  Bottom 0.254: v56.13,9.78 55.97,9.62 arc-45 55.75,9.53 v45.09,9.53
MOTA
  Top 0.254: JP9.2 22.46,34.56 arc-45 22.68,34.47 37.3,19.85 arc45 37.52,19.76 U$1.34
MOTB
  Top 0.254: JP9.4 9.26,35.65 arc45 9.48,35.56 22.73,35.56 arc-45 22.95,35.47 38.07,20.35 arc45 38.29,20.26 U$1.33
N$2
  Top 0.254: C2.+ U$1.56
N$3  (via drill 0.6)
  Top 0.508: R3.1 arc-90 69.64,34.29 v68.58,34.29 | v68.58,25.4 arc90 69.77,26.59 69.77,26.81 arc-90 71.07,28.11 68.56,28.11 arc-90 69.77,26.75 69.79,28.19 arc90 JP3.2
  Bottom 0.508: v68.58,25.4 v68.58,34.29
N$4
  Top 1.016: SW1.2 SW1.5 53.34,44.45 | C6.1 62.85,44.59 arc45 62.67,44.66 C5.+ 59.97,45.65 arc45 59.75,45.74 P4.2 arc-90 56.46,45.72 54.61,45.72 | 52.07,45.72 50.67,45.72 | 50.67,45.72 50.67,46.99 arc90 52.07,45.72 | 50.67,45.72 50.67,44.45 arc-90 52.07,45.72 | 53.34,44.45 arc90 52.07,45.72 | 53.34,44.45 arc-90 54.61,45.72 | 53.34,44.45 arc90 52.07,45.72 | 52.07,45.72 54.61,45.72
N$6
  Top 0.508: JP7.1 31.6,3.05 arc45 31.83,2.96 R7.2
N$7
  Top 0.508: JP5.1 22.71,3.05 arc45 22.94,2.96 R6.2
N$8
  Top 0.508: JP4.1 13.82,3.05 arc45 14.05,2.96 R5.2
N$9
  Top 0.508: JP6.1 4.93,3.05 arc45 5.16,2.96 R4.2
N$11
  Top 0.254: C17.1 39.62,25.4 IMU2.10
N$12
  pour Bottom (no thermals): 36.32,73.15 37.47,73.15 arc-90 37.85,72.77 37.85,68.96 arc-90 37.59,68.71 35.81,68.71 arc-90 35.56,68.96 35.56,72.77 arc-90 35.94,73.15
  pour Top (no thermals): 36.32,73.15 37.47,73.15 arc-90 37.85,72.77 37.85,68.96 arc-90 37.59,68.71 35.81,68.71 arc-90 35.56,68.96 35.56,72.77 arc-90 35.94,73.15
N$14
  Top 0.254: 41.95,34.29 C19.1 40.51,34.29 arc90 40.12,33.9 IMU2.20
N$15  (via drill 0.6)
  Top 0.508: C25.1 55.88,63.5 arc-90 55.94,63.56 57.12,63.59 arc90 57.81,64.28 57.81,62.9 arc-90 57.78,62.85 57.73,63.11 arc90 57.19,63.58 57.77,63.58 arc-90 D13.8
  Top 0.762: 55.94,63.56 arc-90 55.88,63.62 v55.88,66.67 | v60.96,76.2 56.9,76.33 arc-90 C23.1
  Top 1.016: P5.3 arc-90 50.84,75.14 C21.1 arc-90 56.43,76.84 C23.1
  Bottom 0.762: v60.96,76.2 arc-90 62.23,74.93 62.23,69.85 arc-90 60.96,68.58 56.39,68.58 arc90 55.88,68.07 v55.88,66.67
N$17
  Top 0.508: D13.6 60.33,67.73 arc-45 60.42,67.95 M1.G
N$18
  Top 0.762: M1.D 65.65,69.85 arc90 D1.A
  Top 1.016: D1.A 70.1,71.51 arc90 JP11.2
N$19
  Top 0.254: D15.1 24.75,41.27 21.09,41.27 arc-45 20.86,41.37 8.52,53.71 arc45 8.3,53.8 JP13.4
  Top 0.508: D15.1 25.56,41.33 arc-45 24.98,41.89 | 24.98,41.89 24.98,41.5 arc-90 24.75,41.27 | 24.98,41.89 C26.1
N$20
  Top 0.254: JP13.3 9.03,51.8 arc-45 9.25,51.71 20.86,40.1 arc45 21.09,40.01 D15.2
N$21
  Top 0.254: JP13.2 9.76,49.8 arc-45 9.98,49.71 20.86,38.83 arc45 21.09,38.73 D15.3
N$22  (via drill 0.6)
  Top 0.254: JP13.1 10.49,47.8 arc-45 10.71,47.71 20.86,37.56 arc45 21.09,37.47 v21.59,37.47 D15.4
  Top 0.508: v21.59,43.18 C26.2
  Bottom 0.508: v21.59,37.47 v21.59,43.18
PGEC1_2
  Top 0.254: U$1.17 arc-90 U$1.17 55.19,22.21 arc-90 54.55,22.76 54.55,21.7 arc-90 54.99,22.21 70.63,22.21 arc-90 71.63,21.21 PROG_1.PGEC
PGED1_2
  Top 0.254: U$1.18 54.05,20.88 arc90 54.61,20.32 55.79,21.5 arc-45 56.01,21.59 68.71,21.59 arc-90 69.47,20.83 69.47,18.8 arc45 69.56,18.58 PROG_1.PGED
PRE3.3  (via drill 0.6)
  Top 0.508: D13.1 57.78,59.69 arc-90 58.42,60.33 59.69,60.33 arc-90 60.33,59.69 D13.3 60.33,55.66 C24.1 60.74,54.07 arc45 60.84,53.84 62.14,52.54 arc45 62.36,52.45 v68.07,52.45 | v68.07,49.28 68.07,45.47 arc-45 67.98,45.25 66.77,44.03 arc-45 66.54,43.94 63.5,43.94
  Bottom 0.508: v68.07,49.28 v68.07,52.45
RX2  (via drill 0.6)
  Top 0.254: v35.05,35.81 34.17,35.81 arc-45 33.94,35.91 31.11,38.73 D15.6 | U$1.31 47.55,21.07 arc-90 47.23,20.75 46.25,20.75 arc-90 45.94,21.07 45.94,24.93 arc45 45.84,25.15 v42.93,28.07
  Bottom 0.254: v42.93,28.07 arc-45 42.71,28.16 v35.05,35.81
SCL1  (via drill 0.6)
  Top 0.254: IMU2.23 38.62,35.3 arc-45 38.71,35.52 R9.1 39.38,36.2 v41.66,36.2 | U$1.37 47.47,18.26 v47.75,18.26
  Bottom 0.254: v41.66,36.2 48.23,29.63 arc-90 48.23,29.18 46.7,27.65 arc45 46.61,27.43 46.61,20.32 arc45 46.7,20.1 47.66,19.14 arc-45 47.75,18.92 v47.75,18.26 46.47,16.98 arc-45 46.25,16.89 36.33,16.89 arc-45 36.1,16.98 34,19.08 arc45 33.78,19.18 21.48,19.18 arc-45 21.26,19.27 JP8.2
SDA1  (via drill 0.6)
  Top 0.254: IMU2.24 36.92,33.65 arc-45 36.83,33.88 R8.1 34.27,33.62 arc-45 34.05,33.53 31.88,33.53 | v27.43,33.02 27.85,33.44 arc-45 28.07,33.53 31.88,33.53 | 31.88,33.53 v29.18,30.83 | U$1.36 38.2,18.76 arc45 37.97,18.67 37.81,18.51 arc-45 37.59,18.41 36.33,18.41 arc-45 36.1,18.51 v29.09,25.52 arc-45 v29.08,25.53
  Bottom 0.254: v27.43,33.02 27.43,27.96 22.03,22.56 arc-45 21.8,22.46 JP8.1 | v29.18,30.83 arc45 29.08,30.6 v29.08,25.53
TX2  (via drill 0.6)
  Top 0.254: v35.56,38.1 33.75,39.91 arc45 33.52,40.01 D15.7 | U$1.32 47.05,29.07 arc45 v46.99,29.21
  Bottom 0.254: v46.99,29.21 38.19,38.01 arc45 37.97,38.1 v35.56,38.1
USER
  Top 0.254: U$1.42 38.12,15.76 arc90 37.81,15.44 37.81,14.17 arc-90 37.49,13.86 33.84,13.86 arc-90 USER.2
  Top 0.508: R2.1 35.98,11.59 arc45 35.89,11.81 USER.2

### Text on the board
tPlace: 24V | 2937 | SK | 34A | ES | 1B | SOT | GND | 10uF | 23F | .1uF | Magnet | 3 | 2 | 1 | CC6-2405SF-E | Control | .1uF | EC-B-IS | SI8610 | GND | 3.3V | .1uF | RX | TX | _ | Magnet | 4 | 5 | 6 | 7 | Bottom | GND | 1117 | A | .1uF | .1uF | + | ISO7221 | 10uF | B | .1uF | B | 1k | 1k | 5.1 | + | 2.2nF | A | Motor | _ | 10uF | .1uF | MPU | _ | 9150 | .1uF | + | Gyro | .01uF | Accel | Mag | 10nF | X | X | .01uF | .1uF | .1uF | .1uF | 3 LEDs | Y | Y | Z | Z | .01uF | .1uF | 2.2k | USER | 2.2k | + | 1 | + | 2 | + | 3 | + | 4 | 10uF | .01uF | .1uF | 10k | RESET | GND | 1k | 1k | 1k | 1k
bPlace: I C | 2 | SDA | SCL